# Altium schematic sheet BACKPMAN30_PwrSw.SchDoc
size A3
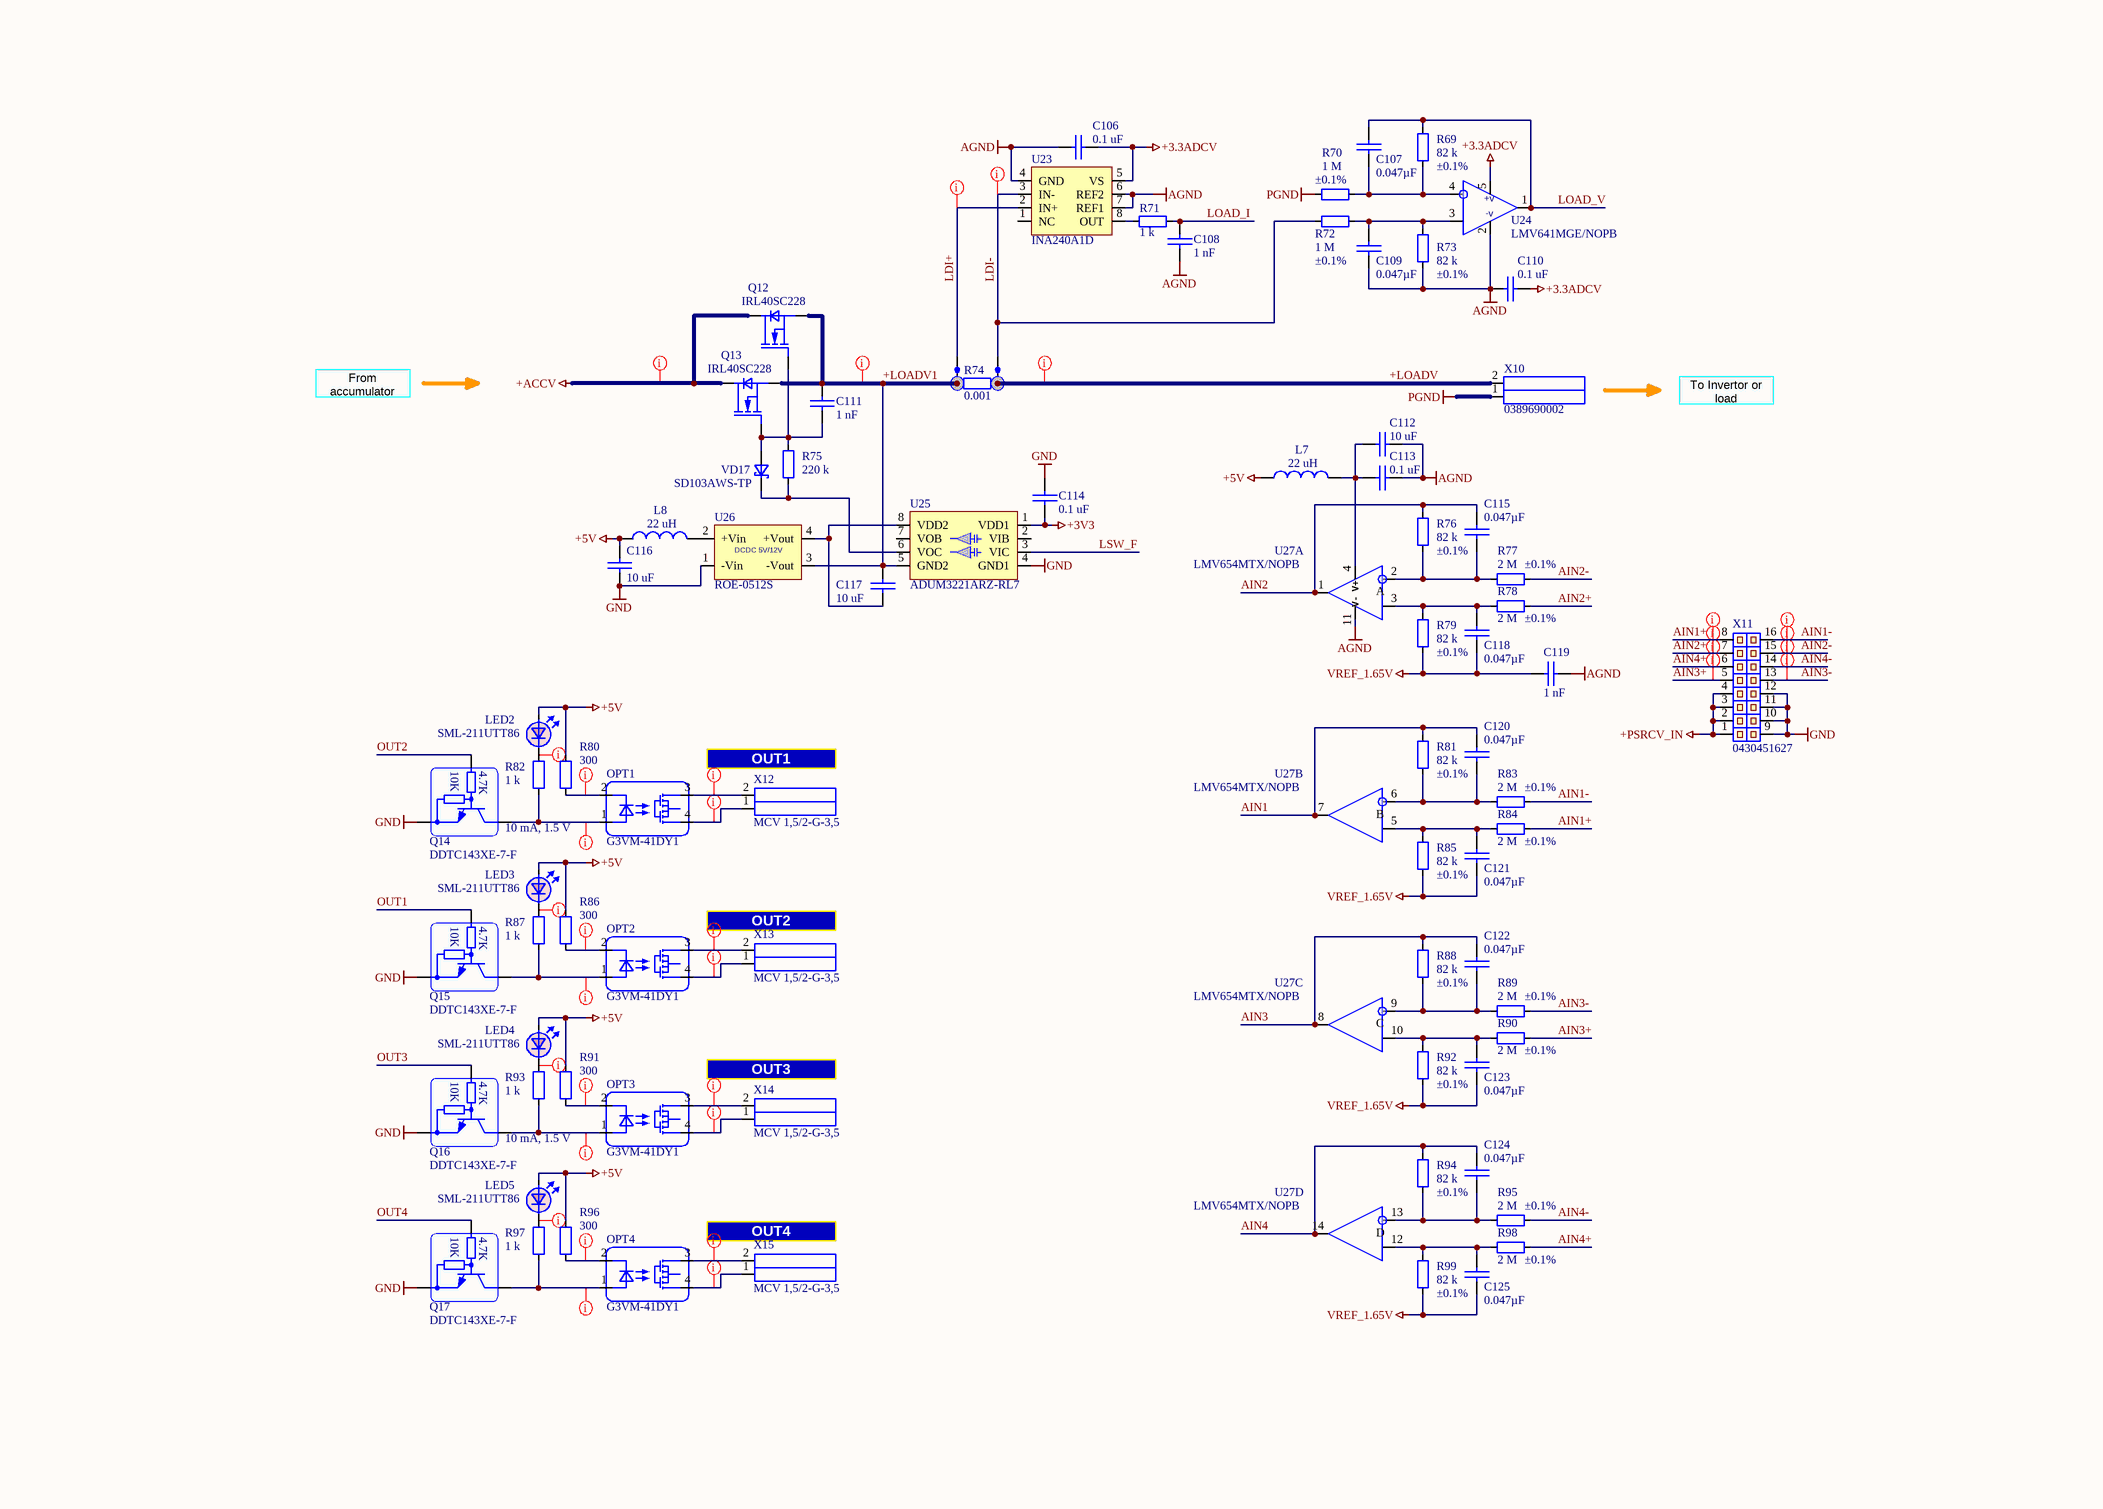
[diagram p0: BACKPMAN30_PwrSw.SchDoc]

## Parts
B4  Net tie 0.3mm  [Net tee 0.3 mm]  (value not drawn)  (net tie, no BOM)
B5  Net tie 0.3mm  [Net tee 0.3 mm]  (value not drawn)  (net tie, no BOM)
C106  value 0.1 uF  [1608[0603]]  (hidden comment: 0603B104K500CT)
C107  value 0.047µF  [0603 CAP]  (hidden comment: Capacitor)
C108  value 1 nF  [0603 CAP]  (hidden comment: Capacitor)
C109  value 0.047µF  [0603 CAP]  (hidden comment: Capacitor)
C110  value 0.1 uF  [1608[0603]]  (hidden comment: 0603B104K500CT)
C111  value 1 nF  [0603 CAP]  (hidden comment: Capacitor)
C112  value 10 uF  [3225[1210]]  (hidden comment: GMC32X7R106K50NT)
C113  value 0.1 uF  [1608[0603]]  (hidden comment: 0603B104K500CT)
C114  value 0.1 uF  [1608[0603]]  (hidden comment: CL10B104KA8NNND)
C115  value 0.047µF  [0603 CAP]  (hidden comment: Capacitor)
C116  value 10 uF  [3225[1210]]  (hidden comment: GMC32X7R106K50NT)
C117  value 10 uF  [3225[1210]]  (hidden comment: GMC32X7R106K50NT)
C118  value 0.047µF  [0603 CAP]  (hidden comment: Capacitor)
C119  value 1 nF  [0603 CAP]  (hidden comment: Capacitor)
C120  value 0.047µF  [0603 CAP]  (hidden comment: Capacitor)
C121  value 0.047µF  [0603 CAP]  (hidden comment: Capacitor)
C122  value 0.047µF  [0603 CAP]  (hidden comment: Capacitor)
C123  value 0.047µF  [0603 CAP]  (hidden comment: Capacitor)
C124  value 0.047µF  [0603 CAP]  (hidden comment: Capacitor)
C125  value 0.047µF  [0603 CAP]  (hidden comment: Capacitor)
L7  value 22 uH  [2518]  (hidden comment: BRC2518T220K)
L8  value 22 uH  [2518]  (hidden comment: BRC2518T220K)
LED2  SML-211UTT86  [0805 LED]
LED3  SML-211UTT86  [0805 LED]
LED4  SML-211UTT86  [0805 LED]
LED5  SML-211UTT86  [0805 LED]
OPT1  G3VM-41DY1  [4-SMD Omron]
OPT2  G3VM-41DY1  [4-SMD Omron]
OPT3  G3VM-41DY1  [4-SMD Omron]
OPT4  G3VM-41DY1  [4-SMD Omron]
Q12  IRL40SC228  [D2Pak-7pin]
Q13  IRL40SC228  [D2Pak-7pin]
Q14  DDTC143XE-7-F  [SOT-523F]
Q15  DDTC143XE-7-F  [SOT-523F]
Q16  DDTC143XE-7-F  [SOT-523F]
Q17  DDTC143XE-7-F  [SOT-523F]
R69  value 82 k  Tolerance: ±0.1%  [0603]  (hidden comment: Resistor)
R70  value 1 M  Tolerance: ±0.1%  [0805]  (hidden comment: RT0805BRE071ML)
R71  value 1 k  [0603]  (hidden comment: Resistor)
R72  value 1 M  Tolerance: ±0.1%  [0805]  (hidden comment: RT0805BRE071ML)
R73  value 82 k  Tolerance: ±0.1%  [0603]  (hidden comment: Resistor)
R74  value 0.001  [WSR52L000FEA]  (hidden comment: WSR51L000FEA)
R75  value 220 k  [0603]  (hidden comment: Resistor)
R76  value 82 k  Tolerance: ±0.1%  [0603]  (hidden comment: Resistor)
R77  value 2 M  Tolerance: ±0.1%  [0805]  (hidden comment: CPF0805B2M0E)
R78  value 2 M  Tolerance: ±0.1%  [0805]  (hidden comment: CPF0805B2M0E)
R79  value 82 k  Tolerance: ±0.1%  [0603]  (hidden comment: Resistor)
R80  value 300  [0603]  (hidden comment: Resistor)
R81  value 82 k  Tolerance: ±0.1%  [0603]  (hidden comment: Resistor)
R82  value 1 k  [0603]  (hidden comment: Resistor)
R83  value 2 M  Tolerance: ±0.1%  [0805]  (hidden comment: CPF0805B2M0E)
R84  value 2 M  Tolerance: ±0.1%  [0805]  (hidden comment: CPF0805B2M0E)
R85  value 82 k  Tolerance: ±0.1%  [0603]  (hidden comment: Resistor)
R86  value 300  [0603]  (hidden comment: Resistor)
R87  value 1 k  [0603]  (hidden comment: Resistor)
R88  value 82 k  Tolerance: ±0.1%  [0603]  (hidden comment: Resistor)
R89  value 2 M  Tolerance: ±0.1%  [0805]  (hidden comment: CPF0805B2M0E)
R90  value 2 M  Tolerance: ±0.1%  [0805]  (hidden comment: CPF0805B2M0E)
R91  value 300  [0603]  (hidden comment: Resistor)
R92  value 82 k  Tolerance: ±0.1%  [0603]  (hidden comment: Resistor)
R93  value 1 k  [0603]  (hidden comment: Resistor)
R94  value 82 k  Tolerance: ±0.1%  [0603]  (hidden comment: Resistor)
R95  value 2 M  Tolerance: ±0.1%  [0805]  (hidden comment: CPF0805B2M0E)
R96  value 300  [0603]  (hidden comment: Resistor)
R97  value 1 k  [0603]  (hidden comment: Resistor)
R98  value 2 M  Tolerance: ±0.1%  [0805]  (hidden comment: CPF0805B2M0E)
R99  value 82 k  Tolerance: ±0.1%  [0603]  (hidden comment: Resistor)
U23  INA240A1D  [8-SOIC Linear]
U24  LMV641MGE/NOPB  [SOT-353 ON Semi]
U25  ADUM3221ARZ-RL7  [8-SOIC Linear]
U26  ROE-0512S  [Recom 4-SIP module]
U27  LMV654MTX/NOPB  [14 TSSOP Maxim]  (parts A,B,C,D of 4)
VD17  SD103AWS-TP  [SOD323]
X10  0389690002  [Molex 389690002]
X11  0430451627  [0430451627]
X12  MCV 1,5/2-G-3,5  [mcv1.5-2-g_3.5 Green  + MC 1,5 2-ST-3,5 - 1840366]
X13  MCV 1,5/2-G-3,5  [mcv1.5-2-g_3.5 Green  + MC 1,5 2-ST-3,5 - 1840366]
X14  MCV 1,5/2-G-3,5  [mcv1.5-2-g_3.5 Green  + MC 1,5 2-ST-3,5 - 1840366]
X15  MCV 1,5/2-G-3,5  [mcv1.5-2-g_3.5 Green  + MC 1,5 2-ST-3,5 - 1840366]

## Nets
+3.3ADCV: C106.1 C110.1 U23.5(VS) U24.5(V+)
+3V3: C114.1 U25.1(VDD1)
+5V: C116.1 L7.1 L8.1 LED2.1 LED3.1 LED4.1 LED5.1 R80.2 R86.2 R91.2 R96.2
+ACCV: Q12.2(D) Q13.2(D)
+PSRCV_IN: X11.1 X11.2 X11.3 X11.4
AGND: C106.2 C108.1 C109.2 C110.2 C112.2 C113.2 C119.1 R73.1 U23.4(GND) U23.6(REF2) U23.7(REF1) U24.2(GND) U27.11(V-)
GND: C114.2 C116.2 Q14.2(E) Q15.2(E) Q16.2(E) Q17.2(E) U25.4(GND1) U26.1(-Vin) X11.9 X11.10 X11.11 X11.12
PGND: R70.1 X10.1
VREF_1.65V: C118.2 C119.2 C121.2 C123.2 C125.2 R79.1 R85.1 R92.1 R99.1
+LOADV: B5.1 R74.1 X10.2
+LOADV1: B4.1 C111.2 C117.1 Q12.3(S) Q13.3(S) R74.2 U25.5(GND2) U26.3(-Vout)
AIN1: C120.1 R81.2 U27.7(OUT)
AIN1+: R84.1 X11.8
AIN1-: R83.1 X11.16
AIN2: C115.1 R76.2 U27.1(OUT)
AIN2+: R78.1 X11.7
AIN2-: R77.1 X11.15
AIN3: C122.1 R88.2 U27.8(OUT)
AIN3+: R90.1 X11.5
AIN3-: R89.1 X11.13
AIN4: C124.1 R94.2 U27.14(OUT)
AIN4+: R98.1 X11.6
AIN4-: R95.1 X11.14
LDI+: B4.2 U23.2(IN+)
LDI-: B5.2 R72.1 U23.3(IN-)
LOAD_I: C108.2 R71.2
LOAD_V: C107.1 R69.2 U24.1(OUT)
LSW_F: U25.3(VIC)
OUT1: Q15.1(B)
OUT2: Q14.1(B)
OUT3: Q16.1(B)
OUT4: Q17.1(B)
NetC107_2: C107.2 R69.1 R70.2 U24.4(IN-)
NetC109_1: C109.1 R72.2 R73.2 U24.3(IN+)
NetC111_1: C111.1 Q12.1(G) Q13.1(G) R75.2 VD17.1(A)
NetC112_1: C112.1 C113.1 L7.2 U27.4(V+)
NetC115_2: C115.2 R76.1 R77.2 U27.2(IN-)
NetC117_2: C117.2 U25.8(VDD2) U26.4(+Vout)
NetC118_1: C118.1 R78.2 R79.2 U27.3(IN+)
NetC120_2: C120.2 R81.1 R83.2 U27.6(IN-)
NetC121_1: C121.1 R84.2 R85.2 U27.5(IN+)
NetC122_2: C122.2 R88.1 R89.2 U27.9(IN-)
NetC123_1: C123.1 R90.2 R92.2 U27.10(IN+)
NetC124_2: C124.2 R94.1 R95.2 U27.13(IN-)
NetC125_1: C125.1 R98.2 R99.2 U27.12(IN+)
NetL8_2: L8.2 U26.2(+Vin)
NetLED2_2: LED2.2 R82.2
NetLED3_2: LED3.2 R87.2
NetLED4_2: LED4.2 R93.2
NetLED5_2: LED5.2 R97.2
NetOPT1_1: OPT1.1 Q14.3(C) R82.1
NetOPT1_2: OPT1.2 R80.1
NetOPT1_3: OPT1.3 X12.2
NetOPT1_4: OPT1.4 X12.1
NetOPT2_1: OPT2.1 Q15.3(C) R87.1
NetOPT2_2: OPT2.2 R86.1
NetOPT2_3: OPT2.3 X13.2
NetOPT2_4: OPT2.4 X13.1
NetOPT3_1: OPT3.1 Q16.3(C) R93.1
NetOPT3_2: OPT3.2 R91.1
NetOPT3_3: OPT3.3 X14.2
NetOPT3_4: OPT3.4 X14.1
NetOPT4_1: OPT4.1 Q17.3(C) R97.1
NetOPT4_2: OPT4.2 R96.1
NetOPT4_3: OPT4.3 X15.2
NetOPT4_4: OPT4.4 X15.1
NetR71_1: R71.1 U23.8(OUT)
NetR75_1: R75.1 U25.6(VOC) VD17.2(C)

Not connected (* = marked no-connect by the designer): U23 1(NC); U25 2(VIB) 7(VOB)

## Layout directives
net class 24V: +ACCV, +LOADV, +LOADV1, AIN1+, AIN1-, AIN2+, AIN2-, AIN3+, AIN3-, AIN4+, AIN4-, LDI+, LDI-, NetOPT1_3, NetOPT1_4, NetOPT2_3, NetOPT2_4, NetOPT3_3, NetOPT3_4, NetOPT4_3, NetOPT4_4
net class 5V: NetLED2_2, NetLED3_2, NetLED4_2, NetLED5_2, NetOPT1_1, NetOPT1_2, NetOPT2_1, NetOPT2_2, NetOPT3_1, NetOPT3_2, NetOPT4_1, NetOPT4_2

## Notes on the sheet
- From accumulator
- To Invertor or load
- OUT1
- (near Q14) 10 mA, 1.5 V
- OUT2
- OUT3
- (near Q16) 10 mA, 1.5 V
- OUT4
- (in symbol DDTC143XE-7-F) 10K; 4.7K
- (in symbol LMV641MGE/NOPB) +v; -v
- (in symbol LMV654MTX/NOPB, part A) A
- (in symbol LMV654MTX/NOPB, part B) B
- (in symbol LMV654MTX/NOPB, part C) C
- (in symbol LMV654MTX/NOPB, part D) D
- (in symbol ROE-0512S) DCDC 5V/12V

## Library data of the parts
C106 C110 C113 C114 = 0603B104K500CT: 0.1 µF ±10% 50V Ceramic Capacitor X7R 0603 (1608 Metric), -55°C ~ 125°C; Manufacturer: Walsin Technology Corporation; PartNum: 1292-1643-1-ND; Tolerance: +-10%; Distributor: Digi-Key; PartName: 0603B104K500CT; Price: 0.0062 Euro; Voltage: 50V
C107 C109 C115 C118 C120-C125 = CC0603JRX7R9BB473: 0.047µF, ±5%, 50V, X7R, 0603 (1608 Metric), -55°C ~ 125°C, -, General Purpose; Manufacturer: Yageo; PartNum: 311-4019-1-ND; Part Number: CC0603JRX7R9BB473; Distributor: Digi-Key; PartName: CC0603JRX7R9BB473; Price: 0.03660; Tolerance: ±5%; Voltage - Rated: 50V; Temperature Coefficient: X7R; Operating Temperature: -55°C ~ 125°C; Features: -; Package / Case: 0603 (1608 Metric)
C108 C111 C119 = CC0603JRX7R9BB102: 1000pF, ±5%, 50V, X7R, 0603 (1608 Metric), -55°C ~ 125°C, -, General Purpose; Manufacturer: Yageo; PartNum: 311-3361-1-ND; Voltage - Rated: 50V; Part Number: CC0603JRX7R9BB102; Distributor: Digi-Key; PartName: CC0603JRX7R9BB102; Price: 0.01920; Tolerance: ±5%; Temperature Coefficient: X7R; Operating Temperature: -55°C ~ 125°C; Features: -; Package / Case: 0603 (1608 Metric)
C112 C116 C117 = GMC32X7R106K50NT: 10 µF ±10%, 50V, Ceramic Capacitor X7R, 1210 (3225 Metric), -55°C ~ 125°C; Manufacturer: CAL-CHIP ELECTRONICS, INC.; PartNum: 2571-GMC32X7R106K50NTTR-ND; Distributor: Digi-Key; PartName: GMC32X7R106K50NT; Tolerance: ±10%; Voltage: 50V
L7 L8 = BRC2518T220K: 22 µH Unshielded Wirewound Inductor, 490 mA, 560mOhm, 1007 (2518 Metric); Manufacturer: Taiyo Yuden; PartNum: 587-2439-1-ND; Tolerance: ±10%; Distributor: Digi-Key; PartName: BRC2518T220K; Supplier 1: Digi-Key; Supplier Part Number 1: 587-2439-1-ND
LED2-LED5 = SML-211UTT86: 0805 red LED, hibright, 2 mA, 1.8V, 130°; Manufacturer: Rohm; PartNum: 511-1292-1-ND; Distributor: Digi-Key; Price: 0.34$; Value: Red; PartName: SML-211UTT86
OPT1-OPT4 = G3VM-41DY1: Solid State AC DC SPST-NO (1 Form A), 0-40V, 2A, 4-SMD (0.300", 7.62mm); Manufacturer: Omron Electronics Inc-EMC Div; PartNum: Z5418CT-ND; Distributor: Digi-Key; Price: 2.9$; PartName: G3VM-41DY1
Q12 Q13 = IRL40SC228: N-Channel 40 V 557A (Tc) 416W (Tc), 0.65mOhm @ 100A, 10V,  Surface Mount D2PAK (7-Lead); Manufacturer: Infineon Technologies; PartNum: IRL40SC228CT-ND; Distributor: Digi-Key; Price: 3.22$; PartName: IRL40SC228
Q14-Q17 = DDTC143XE-7-F: Pre-Biased Bipolar Transistor (BJT) NPN - Pre-Biased 50 V 100 mA 250 MHz 150 mW Surface Mount SOT-523; Manufacturer: Diodes Incorporated; PartNum: DDTC143XE-FDICT-ND; Price: 0.07$; Distributor: Digi-Key; PartName: DDTC143XE-7-F
R69 R73 R76 R79 R81 R85 R88 R92 R94 R99 = ERA-3AEB823V: 82 kOhms, ±0.1%, 0.1W, 1/10W, Thin Film, ±25ppm/°C, 0603 (1608 Metric), -55°C ~ 155°C, Automotive AEC-Q200; Manufacturer: Panasonic Electronic Components; PartNum: P82KDBCT-ND; Voltage: 75V; Distributor: Digi-Key; Price: 0.26; PartName: ERA-3AEB823V; Part Number: ERA-3AEB823V; Temperature Coefficient: ±25ppm/°C; Operating Temperature: -55°C ~ 155°C; Power (Watts): 0.1W, 1/10W; Features: Automotive AEC-Q200; Package / Case: 0603 (1608 Metric)
R70 R72 = RT0805BRE071ML: 1M, ±0.1%, ±50ppm/°C, 0.125W, 1/8W Chip Resistor 0805 (2012 Metric) - Thin Film,-55°C ~ 155°C; Manufacturer: YAGEO; PartNum: YAG4967CT-ND; Distributor: Digi-Key; Price: 0.09$; PartName: RT0805BRE071ML
R71 R82 R87 R93 R97 = RMCF0603FG1K00: 1 kOhms, ±1%, 0.1W, 1/10W, Thick Film, ±100ppm/°C, 0603 (1608 Metric), -55°C ~ 155°C, Automotive AEC-Q200; Manufacturer: Stackpole Electronics Inc.; PartNum: RMCF0603FG1K00CT-ND; Voltage: 75V; Distributor: Digi-Key; Price: 0.00690; Tolerance: ±1%; PartName: RMCF0603FG1K00; Part Number: RMCF0603FG1K00; Temperature Coefficient: ±100ppm/°C; Operating Temperature: -55°C ~ 155°C; Power (Watts): 0.1W, 1/10W; Features: Automotive AEC-Q200; Package / Case: 0603 (1608 Metric)
R74 = WSR51L000FEA: Curr.sens.res. 0.001 OHM 5W 1% 4527 SMD; Manufacturer: Vishay/Dale; PartNum: WSRC-.001CT-ND; Distributor: Digi-Key; Price: 5.27$; Tolerance: 1%; PartName: WSR51L000FEA
R75 = RMCF0603FT220K: 220 kOhms, ±1%, 0.1W, 1/10W, Thick Film, ±100ppm/°C, 0603 (1608 Metric), -55°C ~ 155°C, Automotive AEC-Q200; Manufacturer: Stackpole Electronics Inc.; PartNum: RMCF0603FT220KCT-ND; Voltage: 75V; Distributor: Digi-Key; Price: 0.00690; Tolerance: ±1%; PartName: RMCF0603FT220K; Part Number: RMCF0603FT220K; Temperature Coefficient: ±100ppm/°C; Operating Temperature: -55°C ~ 155°C; Power (Watts): 0.1W, 1/10W; Features: Automotive AEC-Q200; Package / Case: 0603 (1608 Metric)
R77 R78 R83 R84 R89 R90 R95 R98 = CPF0805B2M0E: 2M, ±0.1%, ±25ppm/°C, 0.125W, 1/8W Chip Resistor 0805 (2012 Metric) - Thin Film,-55°C ~ 155°C; Manufacturer: TE Connectivity Passive Product; PartNum: A119974CT-ND; Distributor: Digi-Key; Price: 0.19$; PartName: CPF0805B2M0E
R80 R86 R91 R96 = RMCF0603FT300R: 300 Ohms, ±1%, 0.1W, 1/10W, Thick Film, ±100ppm/°C, 0603 (1608 Metric), -55°C ~ 155°C, Automotive AEC-Q200; Manufacturer: Stackpole Electronics Inc.; PartNum: RMCF0603FT300RCT-ND; Voltage: 75V; Distributor: Digi-Key; Price: 0.00690; Tolerance: ±1%; PartName: RMCF0603FT300R; Part Number: RMCF0603FT300R; Temperature Coefficient: ±100ppm/°C; Operating Temperature: -55°C ~ 155°C; Power (Watts): 0.1W, 1/10W; Features: Automotive AEC-Q200; Package / Case: 0603 (1608 Metric)
U23 = INA240A1D: Current Sense Amplifier, 20V/V, 2V/us, 400KHz, -40°C ~ 125°C, 8-SOIC; Manufacturer: Texas Instruments; PartNum: 296-48837-ND; Price: 3.0$; Distributor: Digi-Key; PartName: INA240A1D; Supplier 1: Digi-Key; Supplier Part Number 1: 296-50472-1-ND
U24 = LMV641MGE/NOPB: OpAmp,  Rail-to-Rail,  10MHz, VSS 2.7V ~ 12V, Vofs 30µV,  SC-70-5, -40°C ~ 125°C; Manufacturer: Texas Instruments; PartNum: LMV641MGE/NOPBCT-ND; Price: 1.8$; Distributor: Digi-Key; PartName: LMV641MGE/NOPB; Supplier 1: Digi-Key; Supplier Part Number 1: 296-OPA991IDBVRCT-ND
U25 = ADUM3221ARZ-RL7: 4A Gate Driver Magnetic Coupling 2500Vrms 2 Channel 8-SOIC, -40°C ~ 125°C; Manufacturer: Analog Devices Inc.; PartNum: ADUM3221ARZ-RL7CT-ND; Distributor: Digi-Key; Price: 3.1$; PartName: ADUM3221ARZ-RL7
U26 = ROE-0512S: Isolated Module DC DC Converter 1 Output 12V - - 84mA 4.5V - 5.5V Input; Manufacturer: Recom Power; PartNum: ROE-0512S-ND; Price: 2.8$; Distributor: Digi-Key; PartName: ROE-0512S; Supplier 1: Digi-Key; Supplier Part Number 1: ROE-0512S-ND
U27 = LMV654MTX/NOPB: General Purpose Amplifier 4 Circuit, Rail-to-Rail,  Vcc 2.7-5.5V, Uoffs 100 uV, 12 MHz,  14-TSSOP, -40°C ~ 125°C; Manufacturer: Texas Instruments; PartNum: 296-42685-1-ND; Price: 1.7$; Distributor: Digi-Key; PartName: LMV654MTX/NOPB
VD17 = SD103AWS-TP: Diode Schottky 40 V 350mA Surface Mount SOD-323, -65°C ~ 125°C; Manufacturer: Micro Commercial Co; PartNum: SD103AWSTPMSCT-ND; PartName: SD103AWS-TP; Distributor: Digi-Key; Price: 0.1$
X10 = 0389690002: 2 Circuit 0.500" (12.70mm) Barrier Block Connector Screws with Captive Plate, 50A, 600V, 8-20AWG; Manufacturer: Molex; PartNum: WM7469-ND; Distributor: Digi-Key; Price: 1.03$; PartName: 0389690002
X11 = 0430451627: Connector Header Through Hole 16 position 0.118" (3.00mm); Manufacturer: Molex; PartNum: WM10708-ND; Distributor: Digi-Key; Price: 2.6$; PartName: 0430451627
X12-X15 = MCV 1,5/2-G-3,5: HEADER, VERTICAL, 3.5MM, 2WAY; Manufacturer: PHOENIX CONTACT; PartNum: 1843606; Distributor: Farnell; PartName: MCV 1,5/2-G-3,5